# EAGLE design Display-2023 (EAGLE 9.6.2)

## Sheet 1 of 2
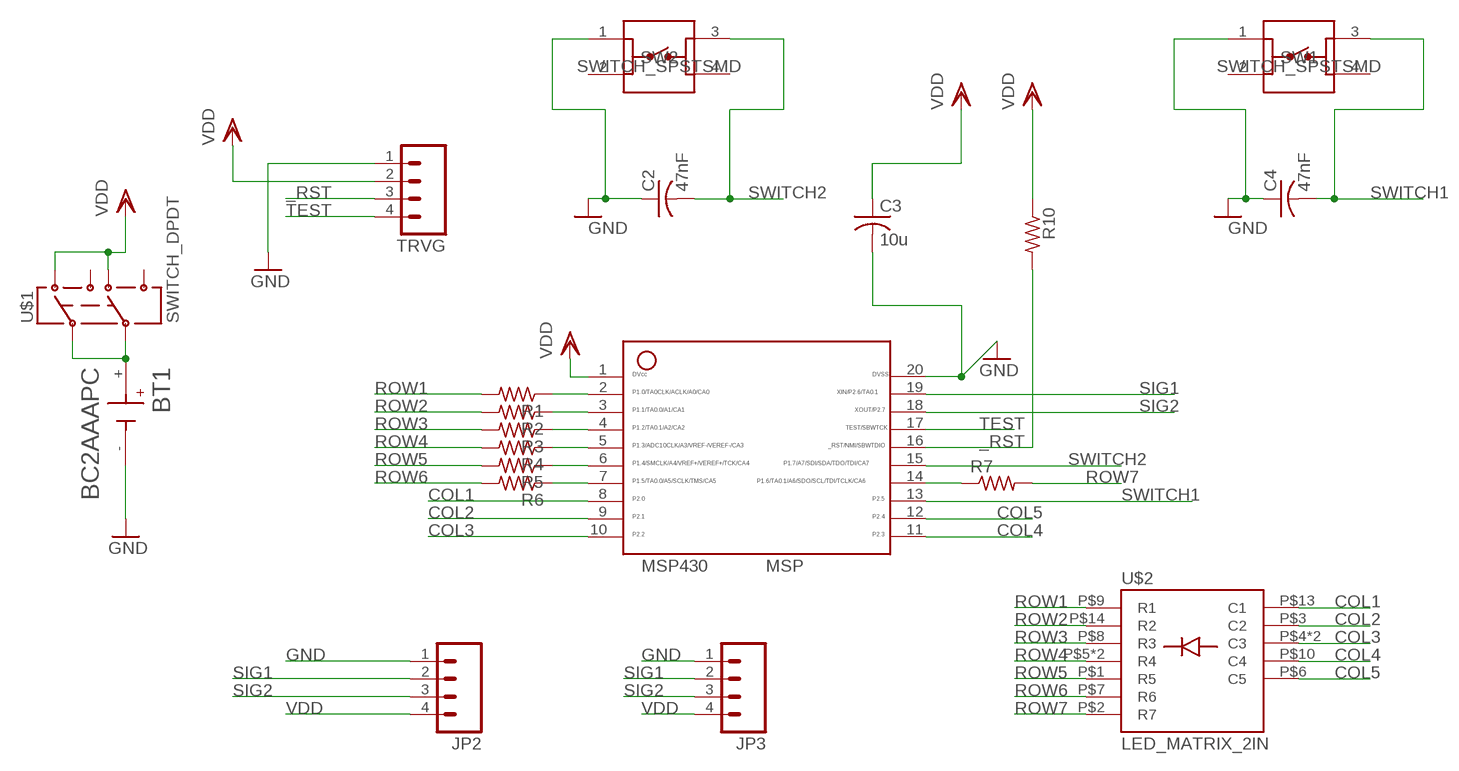
[diagram p0: schematic, sheet 1]

### Parts
BT1  BC2AAAPC  [BAT_BC2AAAPC]
C2  47nF  C-USC0603  [C0603]
C3  10u  C-USC1206  [C1206]
C4  47nF  C-USC0603  [C0603]
JP2  M04LOCK  [1X04_LOCK]
JP3  M04LOCK  [1X04_LOCK]
MSP430  MSP  MSP430  [20_PIN]
R1  R-US_R0402  [R0402]
R2  R-US_R0402  [R0402]
R3  R-US_R0402  [R0402]
R4  R-US_R0402  [R0402]
R5  R-US_R0402  [R0402]
R6  R-US_R0402  [R0402]
R7  R-US_R0402  [R0402]
R10  R-US_R0402  [R0402]
SW1  SWITCH_SPSTSMD  [SW_1571563-4]
SW2  SWITCH_SPSTSMD  [SW_1571563-4]
TRVG  M04LOCK  [1X04_LOCK]
U$1  SWITCH_DPDT  [JS_DPDT_TH]
U$2  LED_MATRIX_2IN  [LED_MATRIX_5_7]

### Nets
_RST: MSP430.16 R10.2 TRVG.3
COL1: MSP430.8 U$2.P$13(C1)
COL2: MSP430.9 U$2.P$3(C2)
COL3: MSP430.10 U$2.P$4(C3) U$2.P$11(C3)
COL4: MSP430.11 U$2.P$10(C4)
COL5: MSP430.12 U$2.P$6(C5)
GND: BT1.- C2.1 C3.2 C4.1 JP2.1 JP3.1 MSP430.20 SW1.1 SW2.1 TRVG.1
N$1: MSP430.14 R7.1
N$3: MSP430.2 R1.1
N$4: MSP430.3 R2.1
N$5: MSP430.4 R3.1
N$6: MSP430.5 R4.1
N$7: MSP430.6 R5.1
N$8: MSP430.7 R6.1
ROW1: R1.2 U$2.P$9(R1)
ROW2: R2.2 U$2.P$14(R2)
ROW3: R3.2 U$2.P$8(R3)
ROW4: R4.2 U$2.P$5(R4) U$2.P$12(R4)
ROW5: R5.2 U$2.P$1(R5)
ROW6: R6.2 U$2.P$7(R6)
ROW7: R7.2 U$2.P$2(R7)
SIG1: JP2.2 JP3.2 MSP430.19
SIG2: JP2.3 JP3.3 MSP430.18
SWITCH1: C4.2 MSP430.13 SW1.3
SWITCH2: C2.2 MSP430.15 SW2.3
TEST: MSP430.17 TRVG.4
VBAT: BT1.+ U$1.2 U$1.5
VDD: C3.1 JP2.4 JP3.4 MSP430.1 R10.1 TRVG.2 U$1.1 U$1.4
Unconnected: SW1.2 SW1.4 SW2.2 SW2.4 U$1.3 U$1.6

## Sheet 2 of 2

## Library data of the parts
BT1 = BC2AAAPC:BC2AAAPC: Holder 2 Aaa Cell w/Pc Pins; DESCRIPTION: BATTERY HOLDER AAA 2 CELL PC PIN; DIGI-KEY_PART_NUMBER: BC2AAAPC-ND; MF: MPD; MP: BC2AAAPC; PACKAGE: None; PURCHASE-URL: https://pricing.snapeda.com/search/part/BC2AAAPC/?ref=eda
C2-C4 = rcl:C-US: CAPACITOR, American symbol; SPICEPREFIX: C
JP2 JP3 TRVG = Pendant:M04: Header 4 Standard 4-pin 0.1" header. Use with straight break away headers (SKU : PRT-00116), right angle break away headers (PRT-00553), swiss pins (PRT-00743), machine pins (PRT-00117), and female headers (PRT-00115). Molex polarized connector foot print use with SKU : PRT-08231 with associated crimp pins and housings.
MSP430 = RatDBS:MSP430: MSP430 20 pins
R1-R7 R10 = rcl:R-US_: RESISTOR, American symbol; SPICEPREFIX: R
SW1 SW2 = ELEC327:SWITCH_SPST: TE Connectivity Alcoswitch, 6mm Switch Tactile OFF (ON) SPST Round Button PC Pins 0.05A 24VDC 100000Cycles 2.55N Thru-Hole Loose Through Hole Version 1825910-7 <https://www.digikey.com/en/products/detail/te-connectivity-alcoswitch-switches/1825910-7/1731414> Surface Mount Version 1571563-4 <https://www.digikey.com/en/products/detail/te-connectivity-alcoswitch-switches/1571563-4/2400231>
U$1 = ELEC327:SWITCH_DPDT
U$2 = ELEC327:LED_MATRIX_2IN

## Board
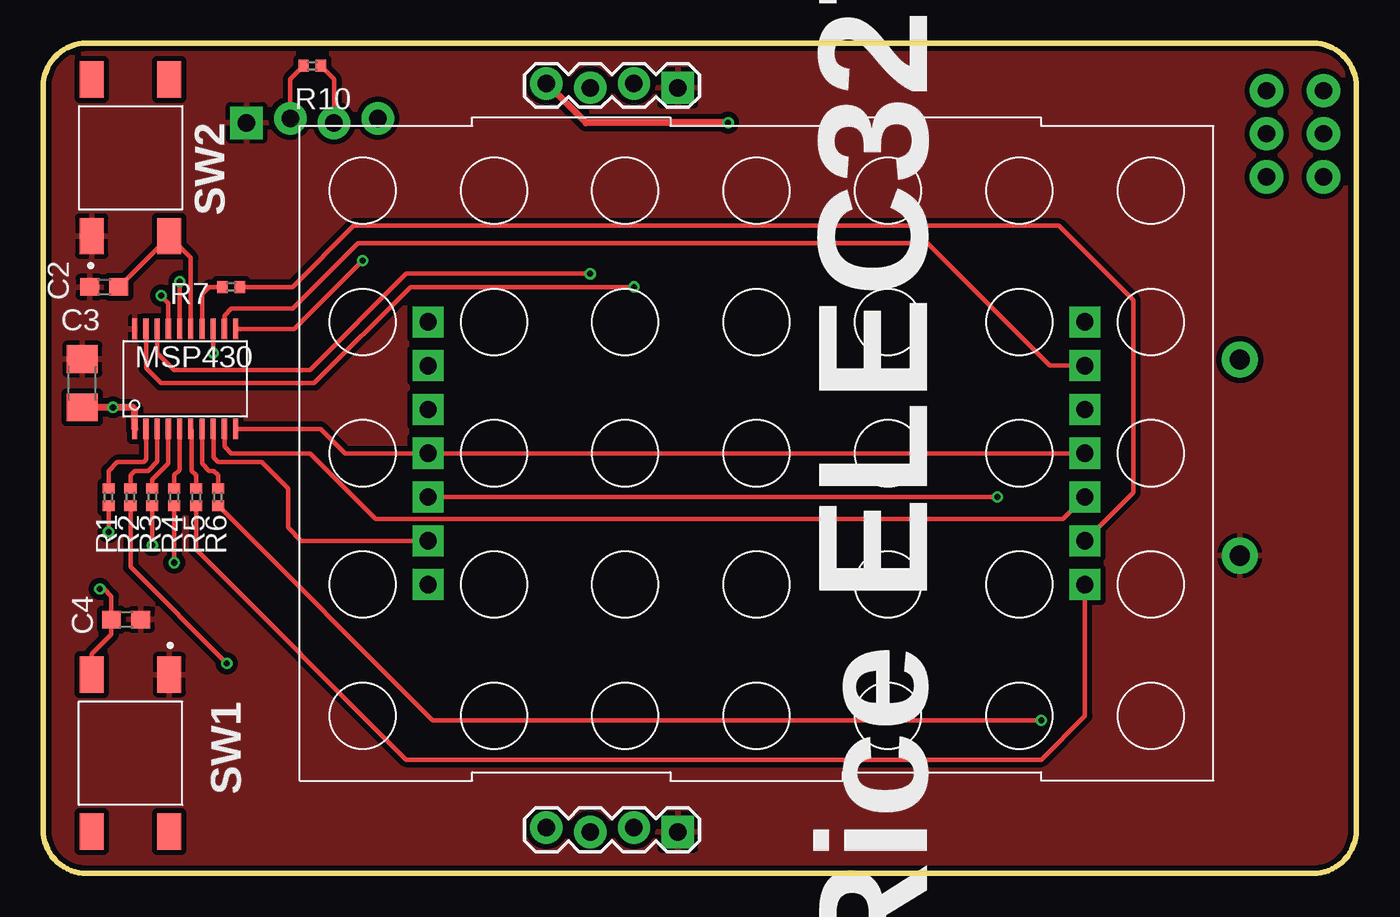
[diagram p1: board, top side]
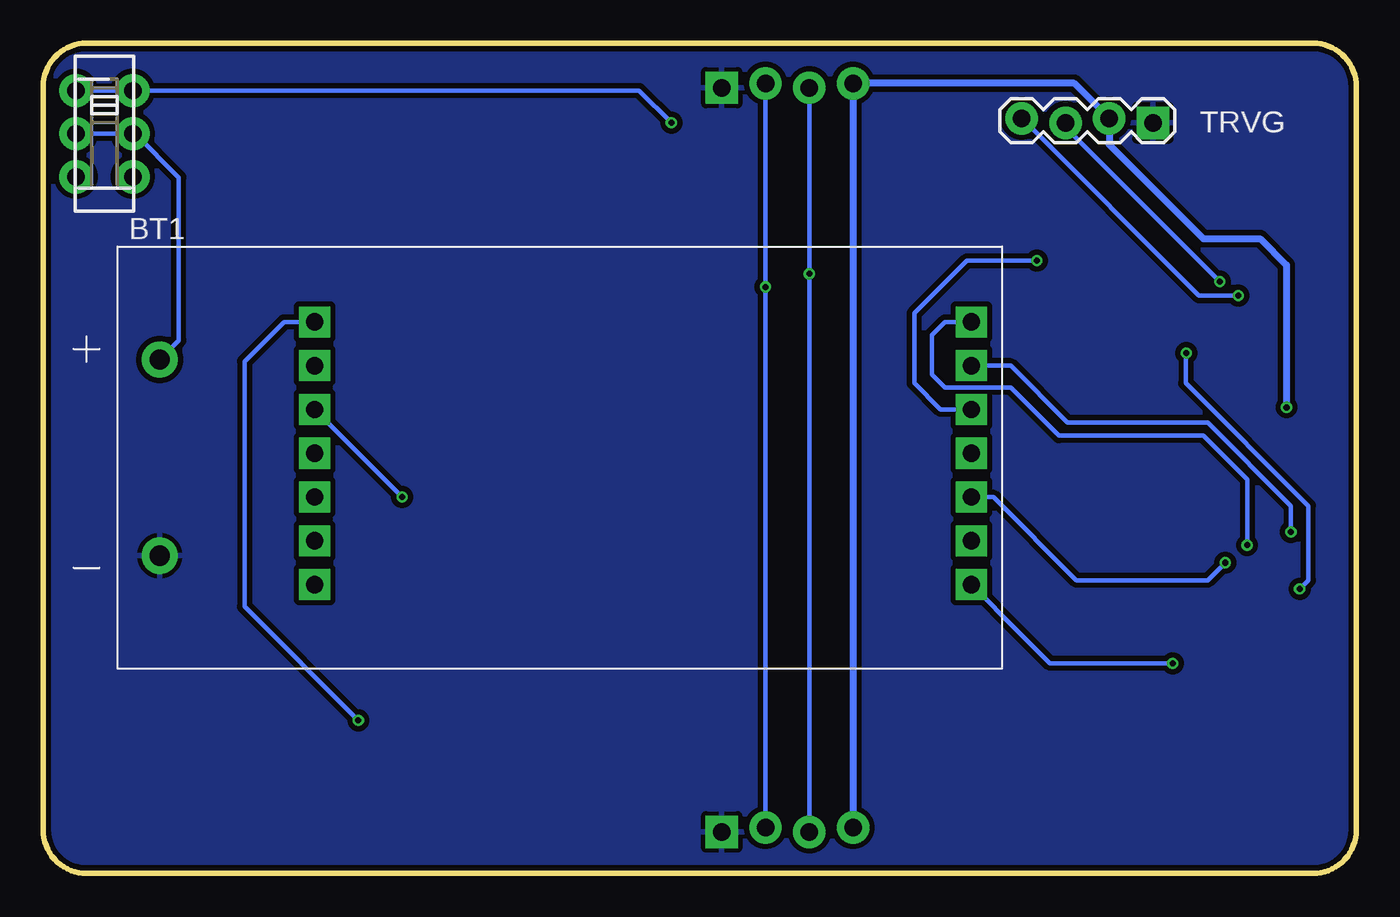
[diagram p2: board, bottom side, seen from below]

Size 76.19 x 48.18 mm. Coordinates in mm from the lower left corner, seen from the top.
Outline: 2.54,0 73.65,0 arc90 76.19,2.54 76.19,45.64 arc90 73.65,48.18 2.54,48.18 arc90 0,45.64 0,2.54 arc90 2.54,0
Copper layers (1*16): Top 0.035mm / dielectric 1.6mm / Bottom 0.035mm
Design rules "jlcpcb-2layers *": minimum track width 5mil, minimum drill 0.3mm, track to track 5mil, track to pad 5mil, pad to pad 5mil, via to via 5mil, smd to smd 5mil, copper to edge 0.2mm, drill to drill 6mil, minimum pad ring 10mil, minimum via ring 6mil, stop-mask expansion 4mil, vias tented up to drill 0mil, thermal gap 10mil

### Footprints (pad centres in the part's own frame; a part is rotated, then mirrored left to right if it is on the bottom)
BAT_BC2AAAPC = drill 1.17: + -23.205,5.69; - -23.205,-5.69
C0603 = smd 1.1 x 1: 1 -0.85,0; 2 0.85,0
C1206 = smd 1.6 x 1.8: 1 -1.4,0; 2 1.4,0
1X04_LOCK = drill 1.016 pad 1.88 square: 1 0,0.127 | drill 1.016 pad 1.88: 2 2.54,-0.127; 3 5.08,0.127; 4 7.62,-0.127
20_PIN = smd 0.3 x 1.2: 1 -2.925,-2.9; 2 -2.275,-2.9; 3 -1.625,-2.9; 4 -0.975,-2.9; 5 -0.325,-2.9; 6 0.325,-2.9; 7 0.975,-2.9; 8 1.625,-2.9; 9 2.275,-2.9; 10 2.925,-2.9; 11 2.925,2.9; 12 2.275,2.9; 13 1.625,2.9; 14 0.975,2.9; 15 0.325,2.9; 16 -0.325,2.9; 17 -0.975,2.9; 18 -1.625,2.9; 19 -2.275,2.9; 20 -2.925,2.9
R0402 = smd 0.6 x 0.7: 1 -0.5,0; 2 0.5,0
SW_1571563-4 = smd 2.1 x 1.4: 1 -4.55,2.25; 2 4.55,2.25; 3 -4.55,-2.25; 4 4.55,-2.25
JS_DPDT_TH = drill 1 pad 1.93: 1 -2.5,-1.65; 2 0,-1.65; 3 2.5,-1.65; 4 -2.5,1.65; 5 0,1.65; 6 2.5,1.65
LED_MATRIX_5_7 = drill 1 square: P$1 -7.62,-19.05; P$2 -5.08,-19.05; P$3 -2.54,-19.05; P$4 0,-19.05; P$5 2.54,-19.05; P$6 5.08,-19.05; P$7 7.62,-19.05; P$8 7.62,19.05; P$9 5.08,19.05; P$10 2.54,19.05; P$11 0,19.05; P$12 -2.54,19.05; P$13 -5.08,19.05; P$14 -7.62,19.05

### Placement (x,y rotation side)
BT1  46.22,24.13 0 bottom
C2  3.55,34.04 0 top
C3  2.28,28.45 90 top
C4  4.82,14.73 180 top
JP2  36.82,2.54 180 top
JP3  36.82,45.72 180 top
MSP430  8.25,28.7 0 top
R1  3.8,21.84 270 top
R2  5.07,21.84 270 top
R3  6.34,21.84 270 top
R4  7.61,21.84 270 top
R5  8.88,21.84 270 top
R6  10.15,21.84 270 top
R7  10.91,34.04 0 top
R10  15.61,46.86 0 top
SW1  5.07,6.99 270 top
SW2  5.07,41.53 90 top
TRVG  11.8,43.69 180 bottom
U$1  72.63,42.93 270 bottom
U$2  41.39,24.38 90 top

### Tracks (layer width: path | path; a pad name or v marks a point on that pad's centre or on a via)
_RST  (via drill 0.35)
  Top 0.254: v7.92,34.35 MSP430.16 | R10.2 16.88,46.09 TRVG.3
  Bottom 0.254: v7.92,34.35 16.88,43.31 TRVG.3
COL1
  Top 0.254: MSP430.8 9.9,25.78 9.9,24.13 10.15,23.88 12.69,23.88 14.21,22.35 14.21,20.07 14.98,19.3 U$2.P$13
COL2
  Top 0.254: MSP430.9 10.52,24.78 10.91,24.38 15.48,24.38 19.29,20.57 59.17,20.57 U$2.P$3
COL3
  Top 0.254: U$2.P$4 U$2.P$11 17.52,24.38 16.1,25.8 MSP430.10
COL4  (via drill 0.35)
  Top 0.254: MSP430.11 14.57,31.6 v18.53,35.56
  Bottom 0.254: U$2.P$10 24.12,26.92 25.64,28.45 25.64,32.51 22.6,35.56 v18.53,35.56
COL5
  Top 0.254: MSP430.12 10.52,32.37 10.91,32.77 14.47,32.77 18.28,36.58 51.3,36.58 58.41,29.46 U$2.P$6
GND
  pour Bottom (isolate 0.305): -0.01,0 -0.01,48.26 76.19,48.26 76.19,0
  pour Top (isolate 0.305): -0.01,0 76.19,0 76.19,48.26 -0.01,48.26
N$1
  Top 0.254: MSP430.14 9.22,33.61 9.64,34.04 R7.1
N$3
  Top 0.254: MSP430.2 5.97,24.01 5.83,23.88 4.31,23.88 3.8,23.37 R1.1
N$4
  Top 0.254: MSP430.3 6.62,23.9 6.09,23.37 5.32,23.37 5.07,23.11 R2.1
N$5
  Top 0.254: R3.1 6.34,22.86 7.27,23.79 MSP430.4
N$6
  Top 0.254: R4.1 7.61,23.11 7.92,23.42 MSP430.5
N$7
  Top 0.254: MSP430.6 8.63,25.75 8.63,23.37 8.88,23.11 R5.1
N$8
  Top 0.254: MSP430.7 9.22,23.79 9.64,23.37 9.9,23.37 10.15,23.11 R6.1
ROW1  (via drill 0.35)
  Top 0.254: R1.2 v3.8,19.81
  Bottom 0.254: v3.8,19.81 R1.2 8.63,26.16 16.75,26.16 20.06,29.46 U$2.P$9
ROW2  (via drill 0.35)
  Top 0.254: R2.2 5.07,17.78 v10.66,12.19
  Bottom 0.254: v10.66,12.19 17.77,12.19 19.55,13.97 U$2.P$14
ROW3  (via drill 0.35)
  Top 0.254: R3.2 v6.34,19.05
  Bottom 0.254: v6.34,19.05 6.34,22.86 8.88,25.4 17.26,25.4 20.06,28.19 23.87,28.19 24.63,28.96 24.63,31.24 23.87,32 U$2.P$8
ROW4  (via drill 0.35)
  Top 0.254: R4.2 v7.61,18.03 | v55.36,21.84 U$2.P$12
  Bottom 0.254: v7.61,18.03 8.63,17.02 16.25,17.02 21.07,21.84 U$2.P$12 | U$2.P$5 v55.36,21.84
ROW5
  Top 0.254: R5.2 8.88,18.8 21.07,6.6 57.9,6.6 60.44,9.14 U$2.P$1
ROW6  (via drill 0.35)
  Top 0.254: R6.2 22.6,8.89 v57.9,8.89
  Bottom 0.254: U$2.P$7 62.22,32 64.51,29.72 64.51,15.49 v57.9,8.89
ROW7
  Top 0.254: R7.2 14.47,34.04 18.02,37.59 58.92,37.59 63.24,33.27 63.24,22.1 U$2.P$2
SIG1  (via drill 0.35)
  Top 0.254: MSP430.19 5.97,29.33 6.85,28.45 15.74,28.45 21.33,34.04 v34.28,34.04
  Bottom 0.254: JP2.2 v34.28,34.04 JP3.2
SIG2  (via drill 0.35)
  Top 0.254: MSP430.18 6.62,30.2 7.61,29.21 15.48,29.21 21.07,34.8 v31.74,34.8
  Bottom 0.254: JP3.3 v31.74,34.8 JP2.3
SWITCH1  (via drill 0.35)
  Top 0.254: MSP430.13 v9.87,30.2 | v3.29,16.51 3.55,16.51 3.97,16.09 C4.2 3.97,13.88 2.82,12.74 SW1.3
  Bottom 0.254: v9.87,30.2 9.9,30.17 9.9,28.45 2.78,21.34 2.78,17.02 v3.29,16.51
SWITCH2
  Top 0.254: MSP430.15 8.57,35.73 7.67,36.63 | 7.67,36.63 SW2.3 | C2.2 6.99,36.63 7.67,36.63
TEST  (via drill 0.35)
  Top 0.254: v6.85,33.53 7.27,33.11 MSP430.17
  Bottom 0.254: TRVG.4 9.13,33.53 v6.85,33.53
VBAT
  Bottom 0.254: BT1.+ 68.32,30.93 68.32,40.39 70.86,42.93 U$1.5 U$1.2
VDD  (via drill 0.35)
  Top 0.254: R10.1 14.34,46.09 TRVG.2
  Top 0.406: v39.74,43.56 31.49,43.56 JP3.4 | MSP430.1 5.32,26.92 5.2,27.05 v4.05,27.05 C3.1
  Bottom 0.254: U$1.1 71.11,45.43 U$1.4 41.61,45.43 v39.74,43.56
  Bottom 0.406: JP2.4 JP3.4 16.37,45.85 TRVG.2 14.34,42.29 8.88,36.83 5.58,36.83 4.05,35.31 v4.05,27.05

### Text on the board
tPlace: Rice ELEC327